# Altium schematic sheet Communication.SchDoc
size A
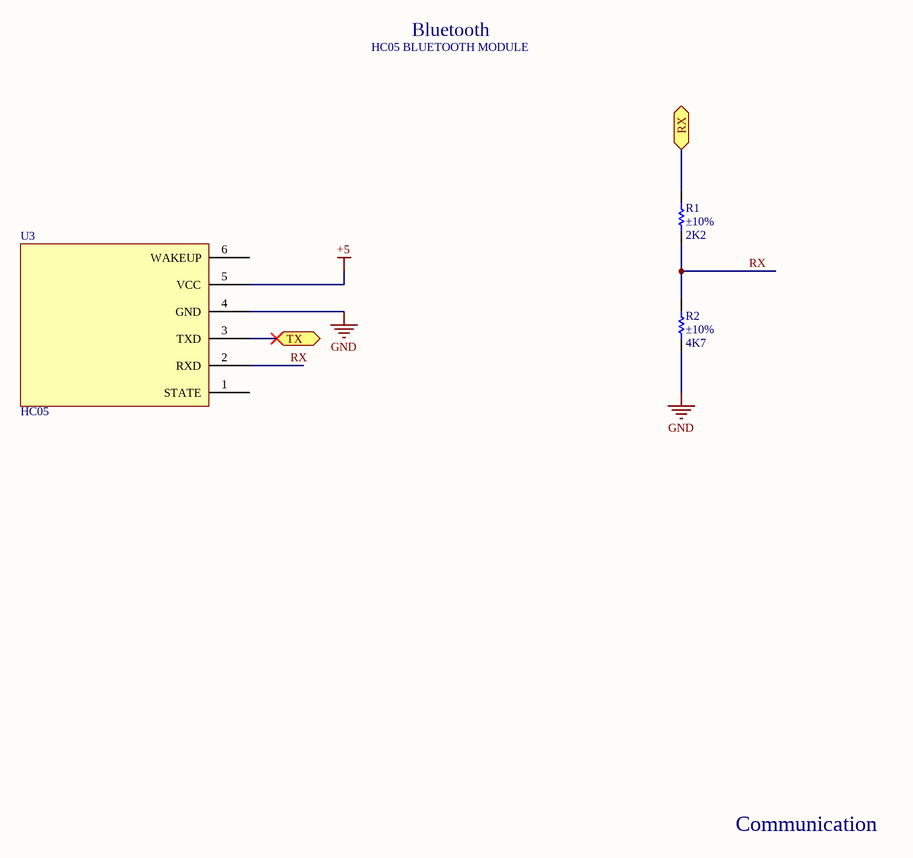
[diagram p0: Communication.SchDoc]

## Parts
R1  Resistance Tolerance: ±10%  Resistance: 2K2  [PCB-4097432-1]  (hidden comment: Bourns CR0805-FX-4701GLF)
R2  Resistance Tolerance: ±10%  Resistance: 4K7  [PCB-4097432-1]  (hidden comment: Bourns CR0805-FX-4701GLF)
U3  HC05  [PCB-y69srl1b5ua4hsssdbd0-1]

## Ports
RX (bidir), TX (bidir)

## Nets
+5: U3.5(VCC)
GND: R2.1 U3.4(GND)
RX: R1.2 ; port RX
RX: R1.1 R2.2 U3.2(RXD)  [a separate net that carries the same name]
TX: U3.3(TXD) ; port TX

Not connected (* = marked no-connect by the designer): U3 1(STATE) 6(WAKEUP)

## Notes on the sheet
- HC05 BLUETOOTH MODULE
- Bluetooth
- Communication

## Library data of the parts
R1 R2 = CMP-97505e06006c4897-1: Res Thick Film 0805 4.7K Ohm 1% 1/8W ±100ppm/°C Molded SMD SMD Paper Tape on Plastic Reel; Voltage Rating (DC): 150 V; Power Rating: 125 mW; Manufacturer Part Number: CR0805-FX-4701GLF; REACH SVHC Compliance: No SVHC; OctopartID: 97505e06006c4897; Packaging: Tape & Reel (TR), Cut Tape (CT); Octopart URL: http://octopart.com/cr0805-fx-4701glf-bourns-6074970; Number of Pins: 2; Mounting Style: Surface Mount; RoHS: Compliant; Size-Thickness: 508 µm; Size-Length: 2.01 mm; Case/Package: 0805; Size-Width: 1.24 mm
U3 = CMP-32y43k4doi7edrbsy63c-2: hc05 BT module; CustomComponentID: 32y43k4doi7edrbsy63c